# Altium schematic sheet Sheet2.SchDoc
size A4
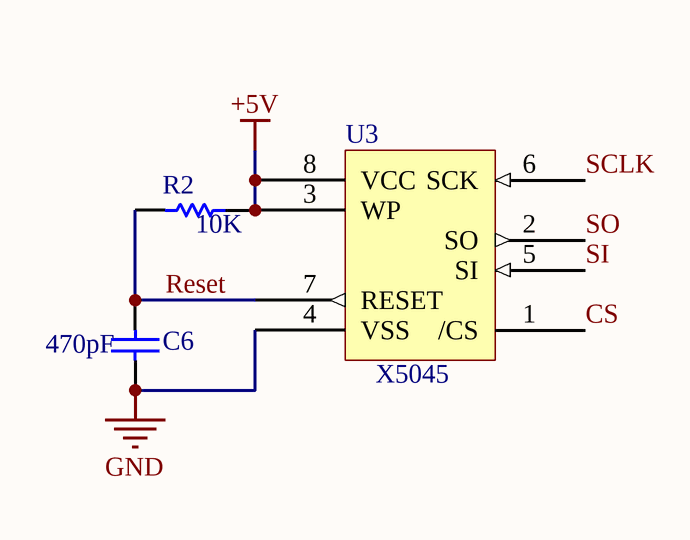
[diagram p0: Sheet2.SchDoc]

## Parts
C6  value 470pF  [RAD-0.3]  (hidden comment: Cap)
R2  10k  [AXIAL-0.3]
U3  X5045  [DIP8]

## Nets
+5V: R2.1 U3.3(WP) U3.8(VCC)
GND: C6.2 U3.4(VSS)
CS: U3.1(/CS)
Reset: C6.1 R2.2 U3.7(RESET)
SCLK: U3.6(SCK)
SI: U3.5(SI)
SO: U3.2(SO)

## Library data of the parts
C6 = Cap: Capacitor; Published: 8-Jun-2000; LatestRevisionDate: 17-Jul-2002; LatestRevisionNote: Re-released for DXP Platform.; PackageReference: RAD-0.3; Publisher: Altium Limited
R2 = Res1: Resistor; Published: 8-Jun-2000; LatestRevisionDate: 17-Jul-2002; LatestRevisionNote: Re-released for DXP Platform.; PackageReference: AXIAL-0.3; Publisher: Altium Limited; Value: 10K
U3 = X5045: EEPROM+Watchdog